# Altium schematic sheet FPGA_RAM.SchDoc: TE0723 - FPGA RAM
size A4; PageSetup: Record=PageOptions|CenterHorizontal=True|CenterVertical=True|PrintScale=0.96|XCorrection=1.00|YCorrection=1.00|PrintKind=0|BorderSize=5000000|LeftOffset=0|BottomOffset=0|Orientation=2|PaperLength=1000|PaperWidth=1000|Scale=100|PaperSource=7|PrintQuality=-4|MediaType=1|DitherType=10|PaperKind=A4|PrintScaleMode=1; Organization: Trenz Electronic GmbH; DocumentNumber: TE0723; Revision: 01; SheetNumber: 6; SheetTotal: 12; Date: 08.07.2015; Author: Indrek Tubalkain; CompanyName: Trenz Electronic GmbH; DrawnBy: Indrek Tubalkain; Engineer: Indrek Tubalkain; ProjectName: TE0723 Arduino
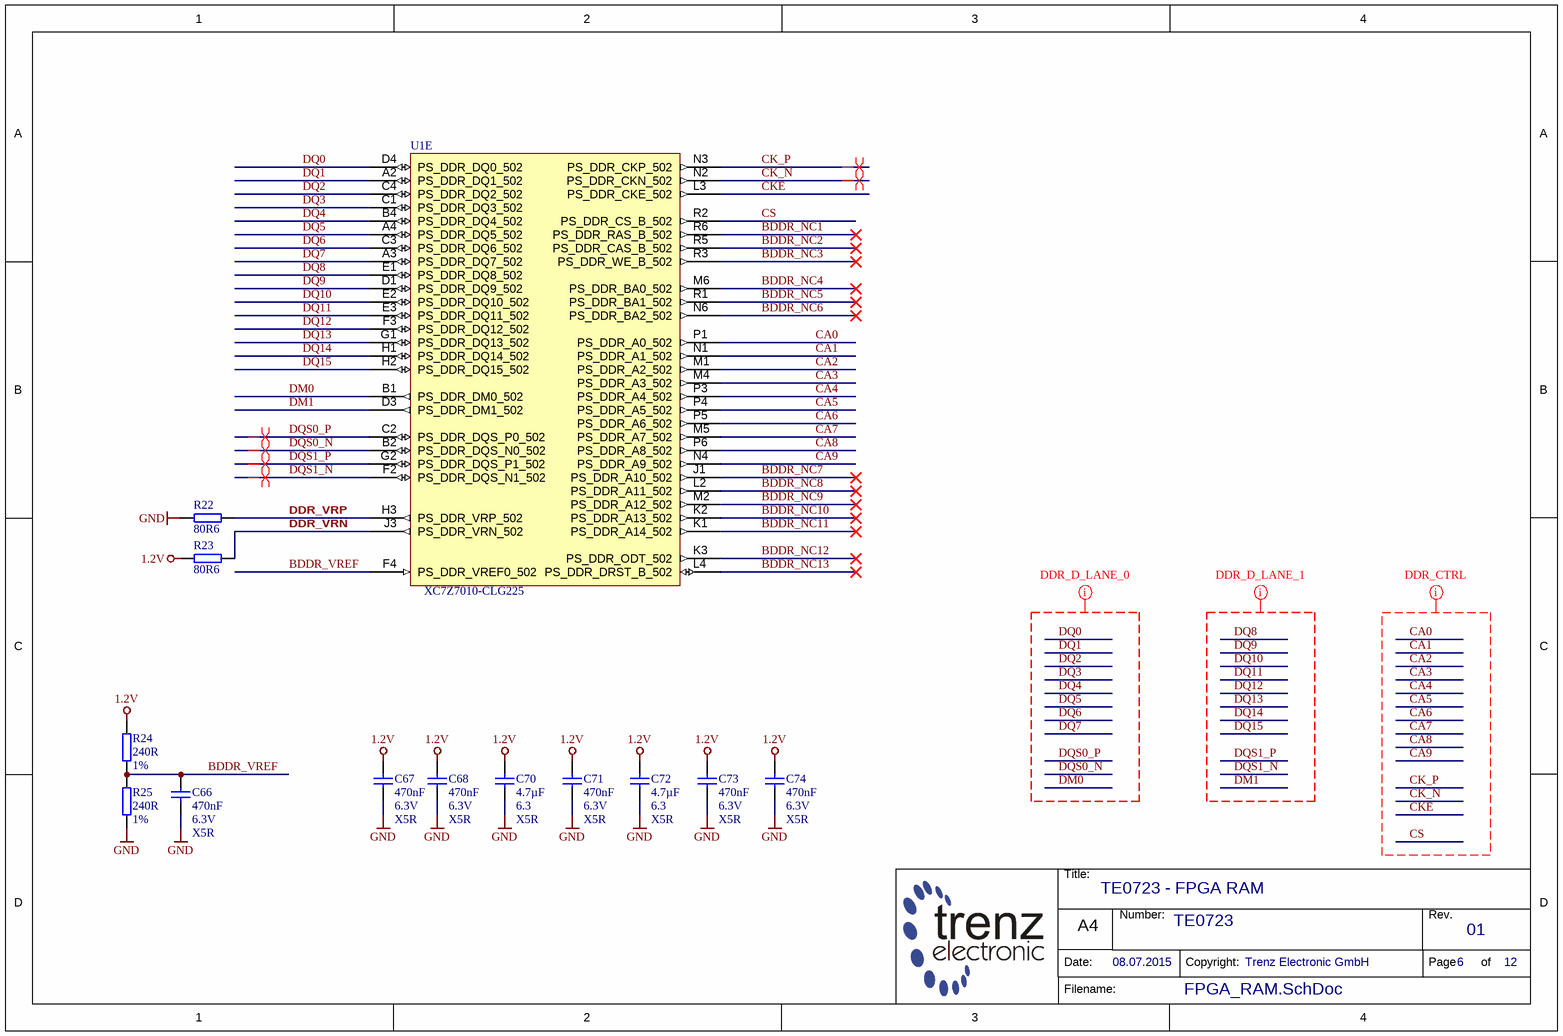
[diagram p0: FPGA_RAM.SchDoc]

## Parts
C66  470nF  Voltage: 6.3V  Technology: X5R  [CAPC0603X33N]
C67  470nF  Voltage: 6.3V  Technology: X5R  [CAPC0603X33N]
C68  470nF  Voltage: 6.3V  Technology: X5R  [CAPC0603X33N]
C70  4.7µF  Voltage: 6.3  Technology: X5R  [CAPC1005X60N]
C71  470nF  Voltage: 6.3V  Technology: X5R  [CAPC0603X33N]
C72  4.7µF  Voltage: 6.3  Technology: X5R  [CAPC1005X60N]
C73  470nF  Voltage: 6.3V  Technology: X5R  [CAPC0603X33N]
C74  470nF  Voltage: 6.3V  Technology: X5R  [CAPC0603X33N]
R22  80R6  [RESC1005X40N]
R23  80R6  [RESC1005X40N]
R24  240R  Tolerance: 1%  [RESC1005X40N]
R25  240R  Tolerance: 1%  [RESC1005X40N]
U1  XC7Z7010-CLG225  (part E of 8)

## Nets
1.2V: C67.1 C68.1 C70.1 C71.2 C72.1 C73.2 C74.1 R23.1 R24.1
GND: C66.2 C67.2 C68.2 C70.2 C71.1 C72.2 C73.1 C74.2 R22.1 R25.2
BDDR_NC1: U1.R6(PS_DDR_RAS_B_502)
BDDR_NC2: U1.R5(PS_DDR_CAS_B_502)
BDDR_NC3: U1.R3(PS_DDR_WE_B_502)
BDDR_NC4: U1.M6(PS_DDR_BA0_502)
BDDR_NC5: U1.R1(PS_DDR_BA1_502)
BDDR_NC6: U1.N6(PS_DDR_BA2_502)
BDDR_NC7: U1.J1(PS_DDR_A10_502)
BDDR_NC8: U1.L2(PS_DDR_A11_502)
BDDR_NC9: U1.M2(PS_DDR_A12_502)
BDDR_NC10: U1.K2(PS_DDR_A13_502)
BDDR_NC11: U1.K1(PS_DDR_A14_502)
BDDR_NC12: U1.K3(PS_DDR_ODT_502)
BDDR_NC13: U1.L4(PS_DDR_DRST_B_502)
BDDR_VREF: C66.1 R24.2 R25.1 U1.F4(PS_DDR_VREF0_502)
CA0: U1.P1(PS_DDR_A0_502)
CA1: U1.N1(PS_DDR_A1_502)
CA2: U1.M1(PS_DDR_A2_502)
CA3: U1.M4(PS_DDR_A3_502)
CA4: U1.P3(PS_DDR_A4_502)
CA5: U1.P4(PS_DDR_A5_502)
CA6: U1.P5(PS_DDR_A6_502)
CA7: U1.M5(PS_DDR_A7_502)
CA8: U1.P6(PS_DDR_A8_502)
CA9: U1.N4(PS_DDR_A9_502)
CK_N: U1.N2(PS_DDR_CKN_502)
CK_P: U1.N3(PS_DDR_CKP_502)
CKE: U1.L3(PS_DDR_CKE_502)
CS: U1.R2(PS_DDR_CS_B_502)
DDR_VRN: R23.2 U1.J3(PS_DDR_VRN_502)
DDR_VRP: R22.2 U1.H3(PS_DDR_VRP_502)
DM0: U1.B1(PS_DDR_DM0_502)
DM1: U1.D3(PS_DDR_DM1_502)
DQ0: U1.D4(PS_DDR_DQ0_502)
DQ1: U1.A2(PS_DDR_DQ1_502)
DQ2: U1.C4(PS_DDR_DQ2_502)
DQ3: U1.C1(PS_DDR_DQ3_502)
DQ4: U1.B4(PS_DDR_DQ4_502)
DQ5: U1.A4(PS_DDR_DQ5_502)
DQ6: U1.C3(PS_DDR_DQ6_502)
DQ7: U1.A3(PS_DDR_DQ7_502)
DQ8: U1.E1(PS_DDR_DQ8_502)
DQ9: U1.D1(PS_DDR_DQ9_502)
DQ10: U1.E2(PS_DDR_DQ10_502)
DQ11: U1.E3(PS_DDR_DQ11_502)
DQ12: U1.F3(PS_DDR_DQ12_502)
DQ13: U1.G1(PS_DDR_DQ13_502)
DQ14: U1.H1(PS_DDR_DQ14_502)
DQ15: U1.H2(PS_DDR_DQ15_502)
DQS0_N: U1.B2(PS_DDR_DQS_N0_502)
DQS0_P: U1.C2(PS_DDR_DQS_P0_502)
DQS1_N: U1.F2(PS_DDR_DQS_N1_502)
DQS1_P: U1.G2(PS_DDR_DQS_P1_502)

## Layout directives
net class DDR_D_LANE_0: DM0, DQ0, DQ1, DQ2, DQ3, DQ4, DQ5, DQ6, DQ7, DQS0_N, DQS0_P
net class DDR_D_LANE_1: DM1, DQ8, DQ9, DQ10, DQ11, DQ12, DQ13, DQ14, DQ15, DQS1_N, DQS1_P
differential pair: CK_N, CK_P, DQS0_N, DQS0_P, DQS1_N, DQS1_P
net class DDR_CTRL: CA0, CA1, CA2, CA3, CA4, CA5, CA6, CA7, CA8, CA9, CK_N, CK_P, CKE, CS

## Notes on the sheet
- Title:
- Number:
- Rev.
- Date:
- A4
- Copyright:
- Page
- of
- Filename:

## Library data of the parts
C66-C68 C74 = 24921: KON 470nF X5R 6.3V SMD 20%; AN: 24921; Mixed: SMT; Value: 470n; Preferred: Yes; Case: 0603 (0201); Tolerance: 20%
C70 C72 = 24719: KON 4.7µF 6.3V X5R SMD 20%; AN: 24719; Mixed: SMT; Value: 4.7u; Preferred: Yes; Case: 1005 (0402); Tolerance: 20%
C71 C73 = 24921: KON 470nF X5R 6.3V SMD 20%; AN: 24921; Value: 470n; Mixed: SMT; Preferred: Yes; Case: 0603 (0201); Tolerance: 20%
R22 R23 = 25100: WID SMD 80R6 1% 0,063W; AN: 25100; Mixed: SMT; Value: 80.6; Preferred: Yes; Tolerance: 1%; Case: 1005 (0402)
R24 R25 = 23661: WID SMD 240R 1% 0,063W; AN: 23661; Mixed: SMT; Value: 240; Preferred: Yes; Case: 1005 (0402)